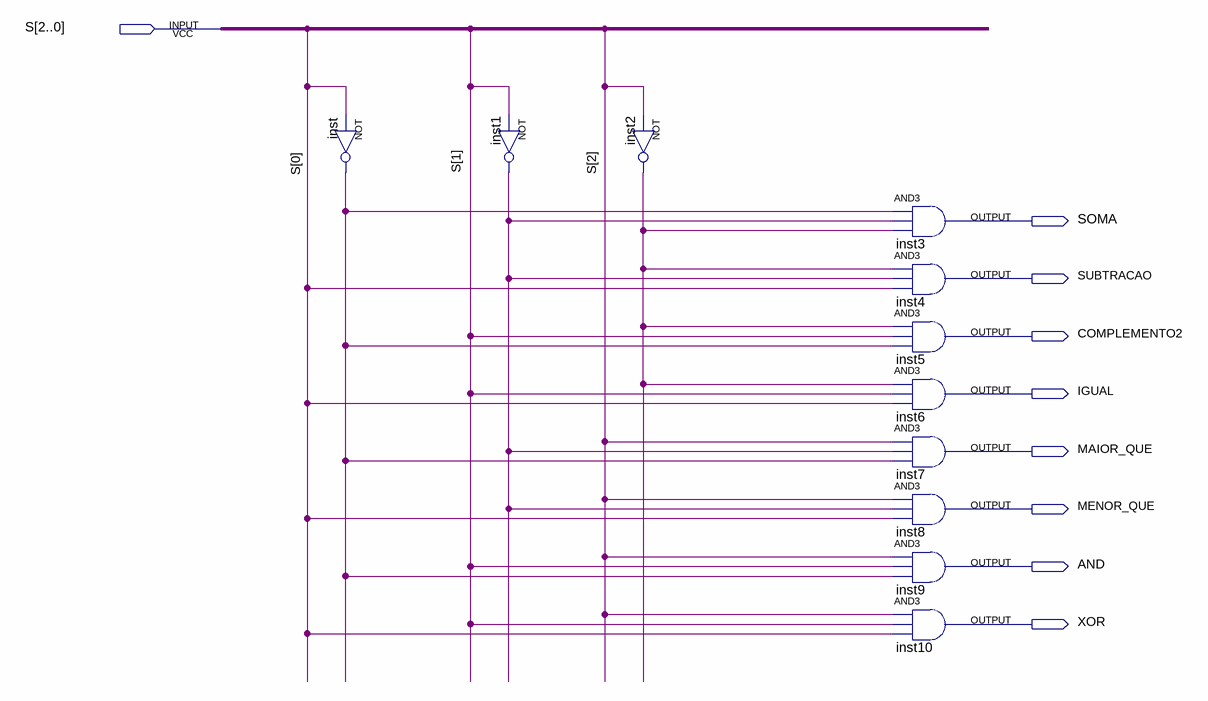
[diagram p0: schematic sheet]
// Quartus schematic Seletor.bdf as structural Verilog: 11 symbols, 9 pins
module Seletor (
  input  [2:0] S,
  output SOMA,
  output SUBTRACAO,
  output COMPLEMENTO2,
  output IGUAL,
  output MAIOR_QUE,
  output MENOR_QUE,
  output AND,
  output XOR
);

  wire inst1_out, inst2_out, inst_out;

  not inst (inst_out, S[0]);
  not inst1 (inst1_out, S[1]);
  not inst2 (inst2_out, S[2]);
  and inst3 (SOMA, inst_out, inst1_out, inst2_out);
  and inst4 (SUBTRACAO, inst2_out, inst1_out, S[0]);
  and inst5 (COMPLEMENTO2, inst2_out, S[1], inst_out);
  and inst6 (IGUAL, inst2_out, S[1], S[0]);
  and inst7 (MAIOR_QUE, S[2], inst1_out, inst_out);
  and inst8 (MENOR_QUE, S[2], inst1_out, S[0]);
  and inst9 (AND, S[2], S[1], inst_out);
  and inst10 (XOR, S[2], S[1], S[0]);
endmodule
